# EAGLE design riser-1u-sdcard (EAGLE 5.09)
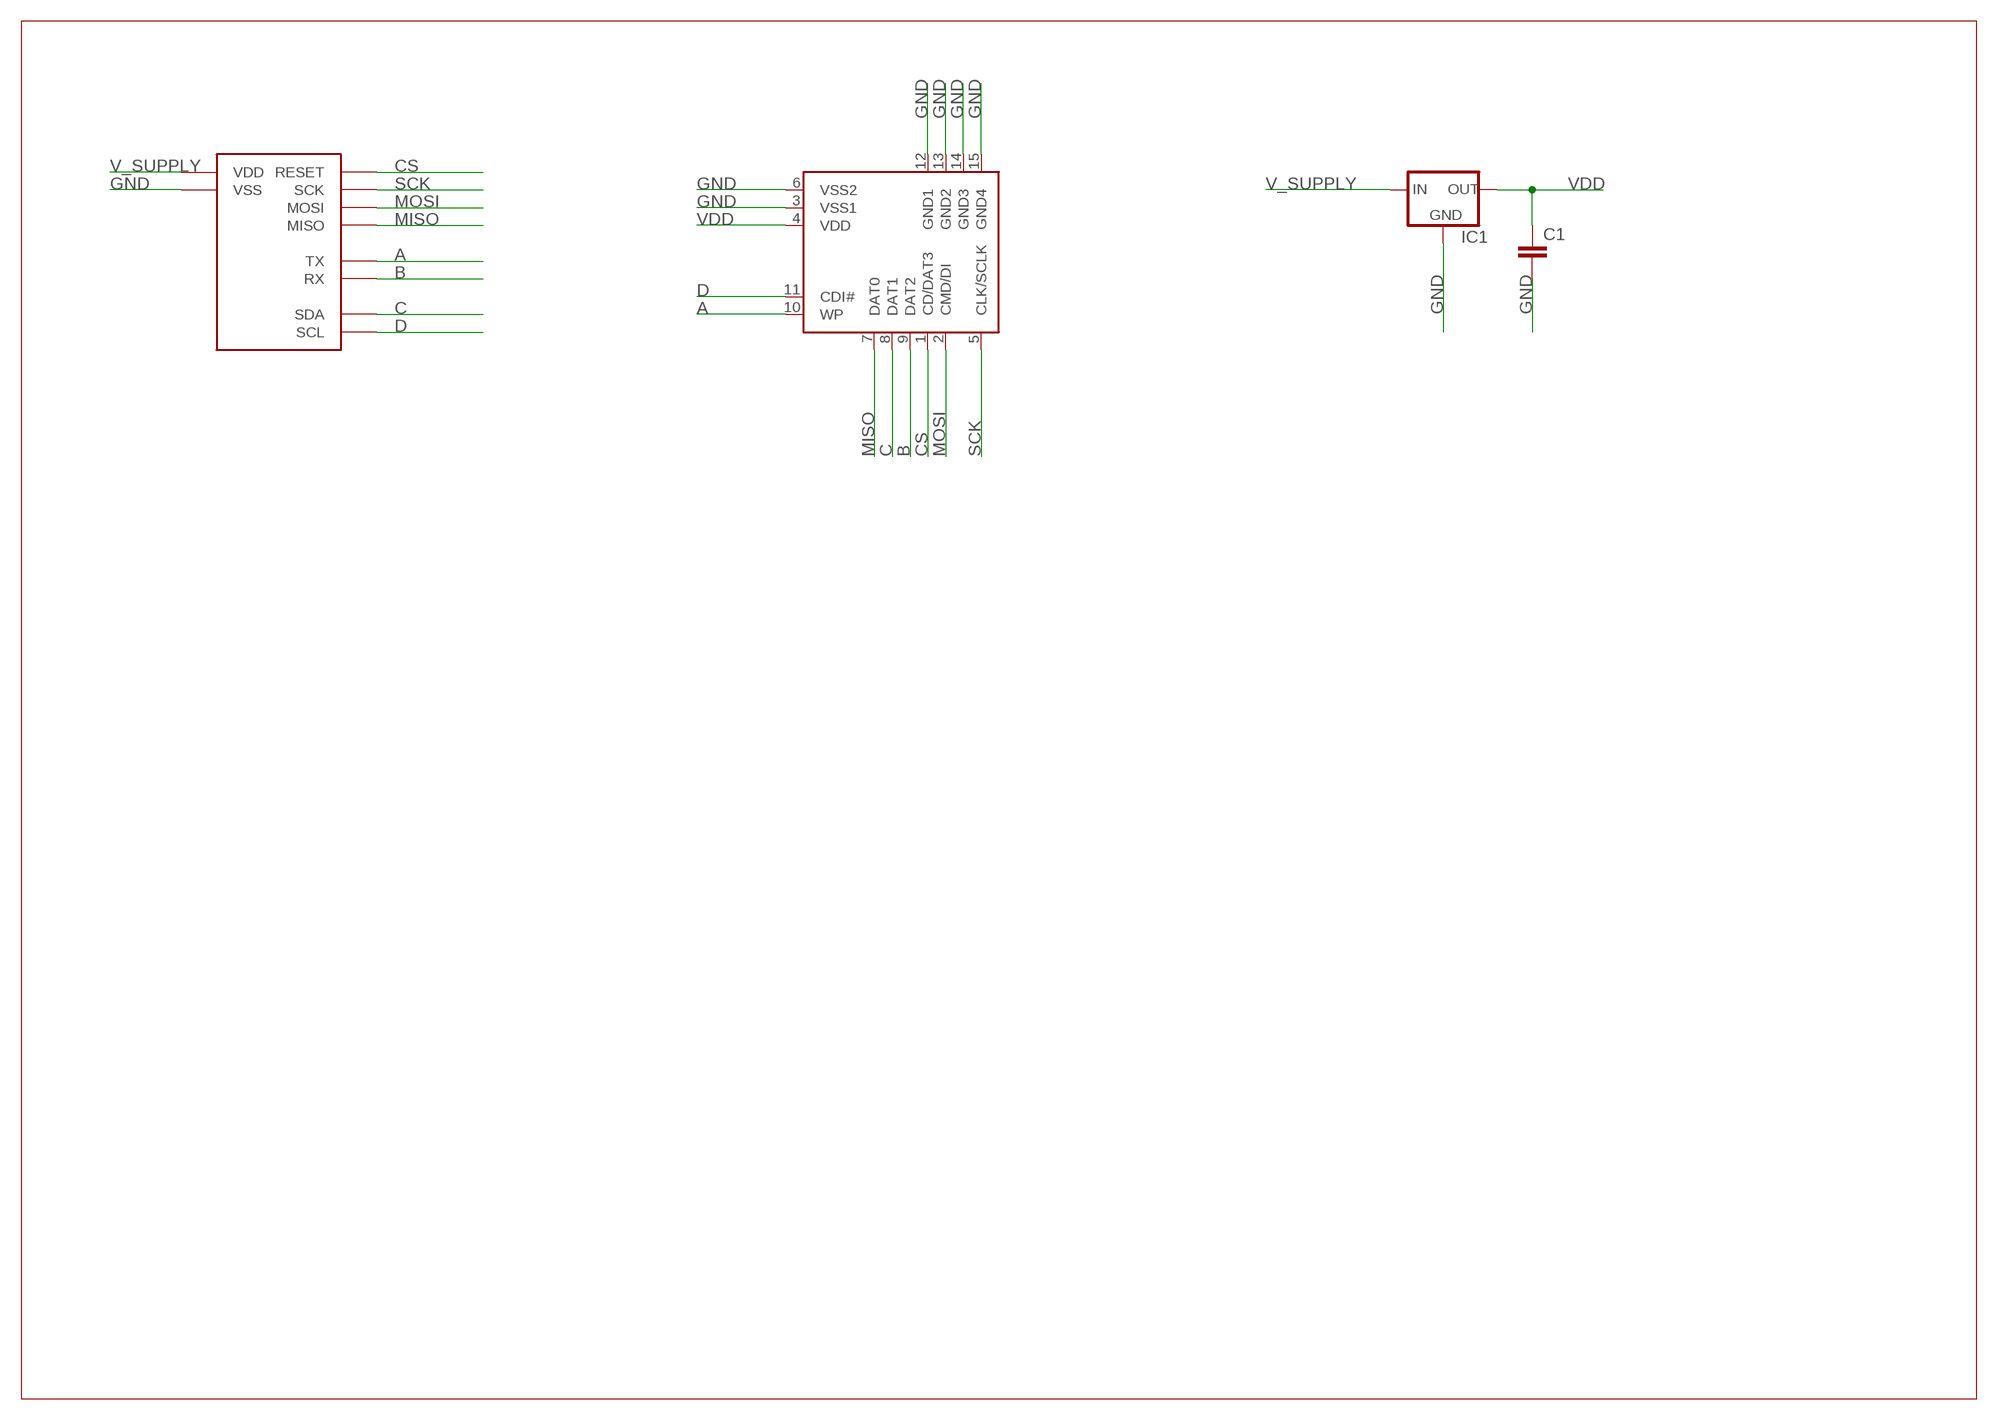
[diagram p0: schematic, sheet 1]

## Parts
C1  C-EUC1206  [C1206]
IC1  LM1117TO252  [TO252]
U$1  UNI_BOARD_CONNECTOR_10  [UNI_BOARD_CONN_10]
U$2  SDCARDVAR2  [SDCMF-10915W010]

## Nets
A: U$1.C$7(TX) U$2.10(WP)
B: U$1.C$9(RX) U$2.9(DAT2)
C: U$1.C$8(SDA) U$2.8(DAT1)
CS: U$1.C$5(RESET) U$2.1(CD/DAT3)
D: U$1.C$10(SCL) U$2.11(CDI#)
GND: C1.2 IC1.1(GND) U$1.C$6(VSS) U$2.3(VSS1) U$2.6(VSS2) U$2.12(GND1) U$2.13(GND2) U$2.14(GND3) U$2.15(GND4)
MISO: U$1.C$1(MISO) U$2.7(DAT0)
MOSI: U$1.C$4(MOSI) U$2.2(CMD/DI)
SCK: U$1.C$3(SCK) U$2.5(CLK/SCLK)
V_SUPPLY: IC1.2(IN) U$1.C$2(VDD)
VDD: C1.1 IC1.3(OUT) U$2.4(VDD)

## Library data of the parts
C1 = rcl:C-EU: CAPACITOR, European symbol
IC1 = my-v-reg-3:LM1117
U$1 = my-uni-board-conn:UNI_BOARD_CONNECTOR_10
U$2 = kingfont_sdcmf10915w010_covek:SDCARD: SD card connector KINGFONT SDCMF-10915W010

## Net classes
1 isolated: width 0.813 mm, clearance 2.54 mm

## Board
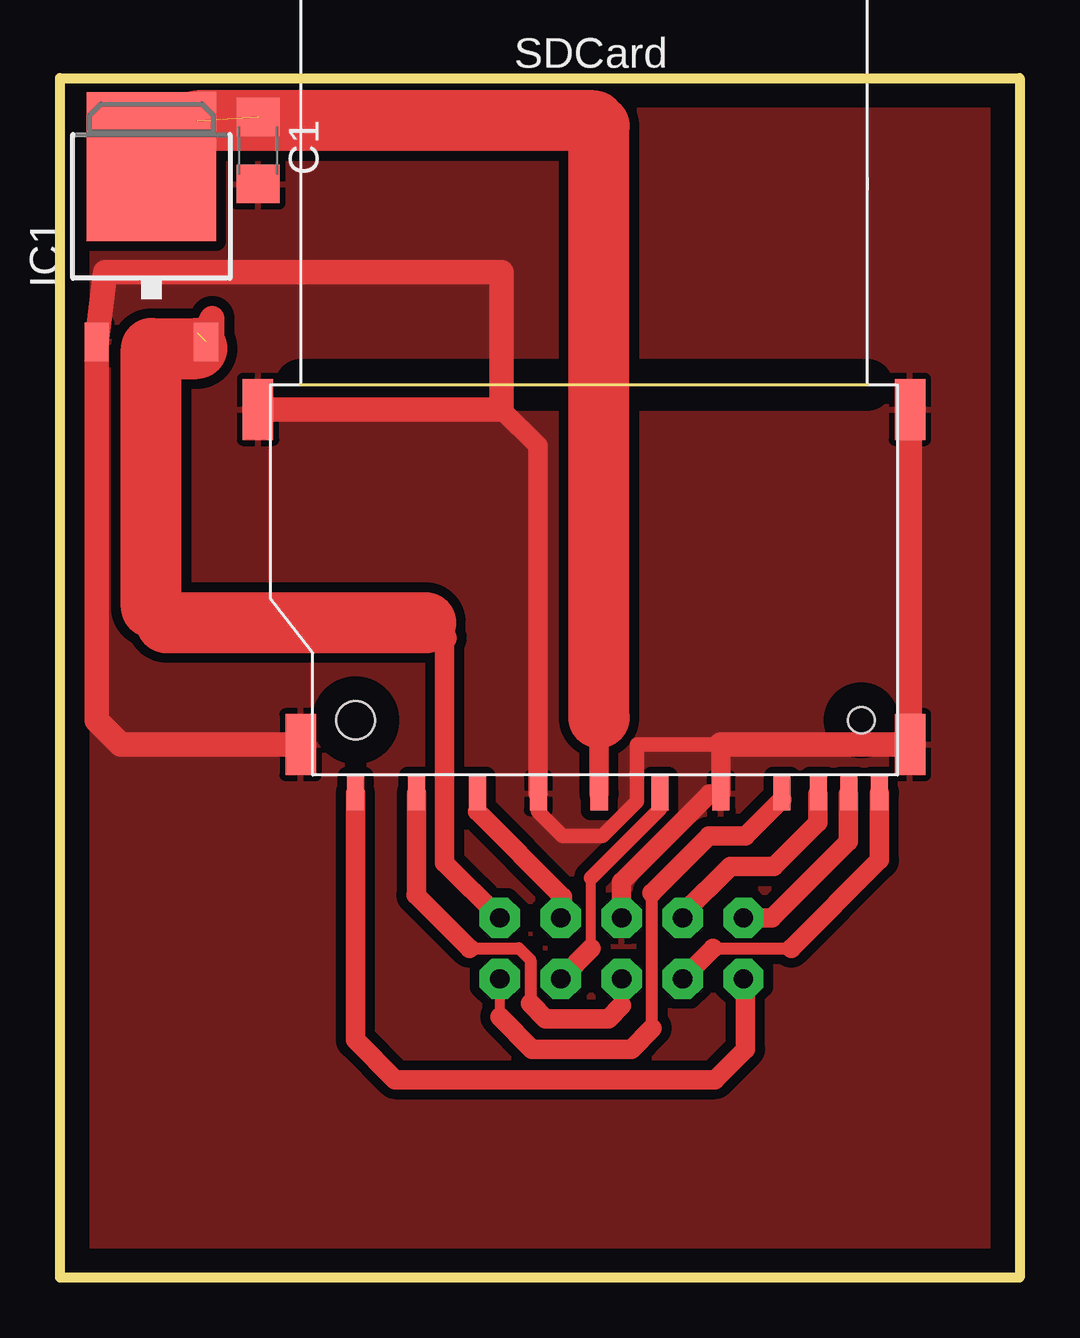
[diagram p1: board, top side]
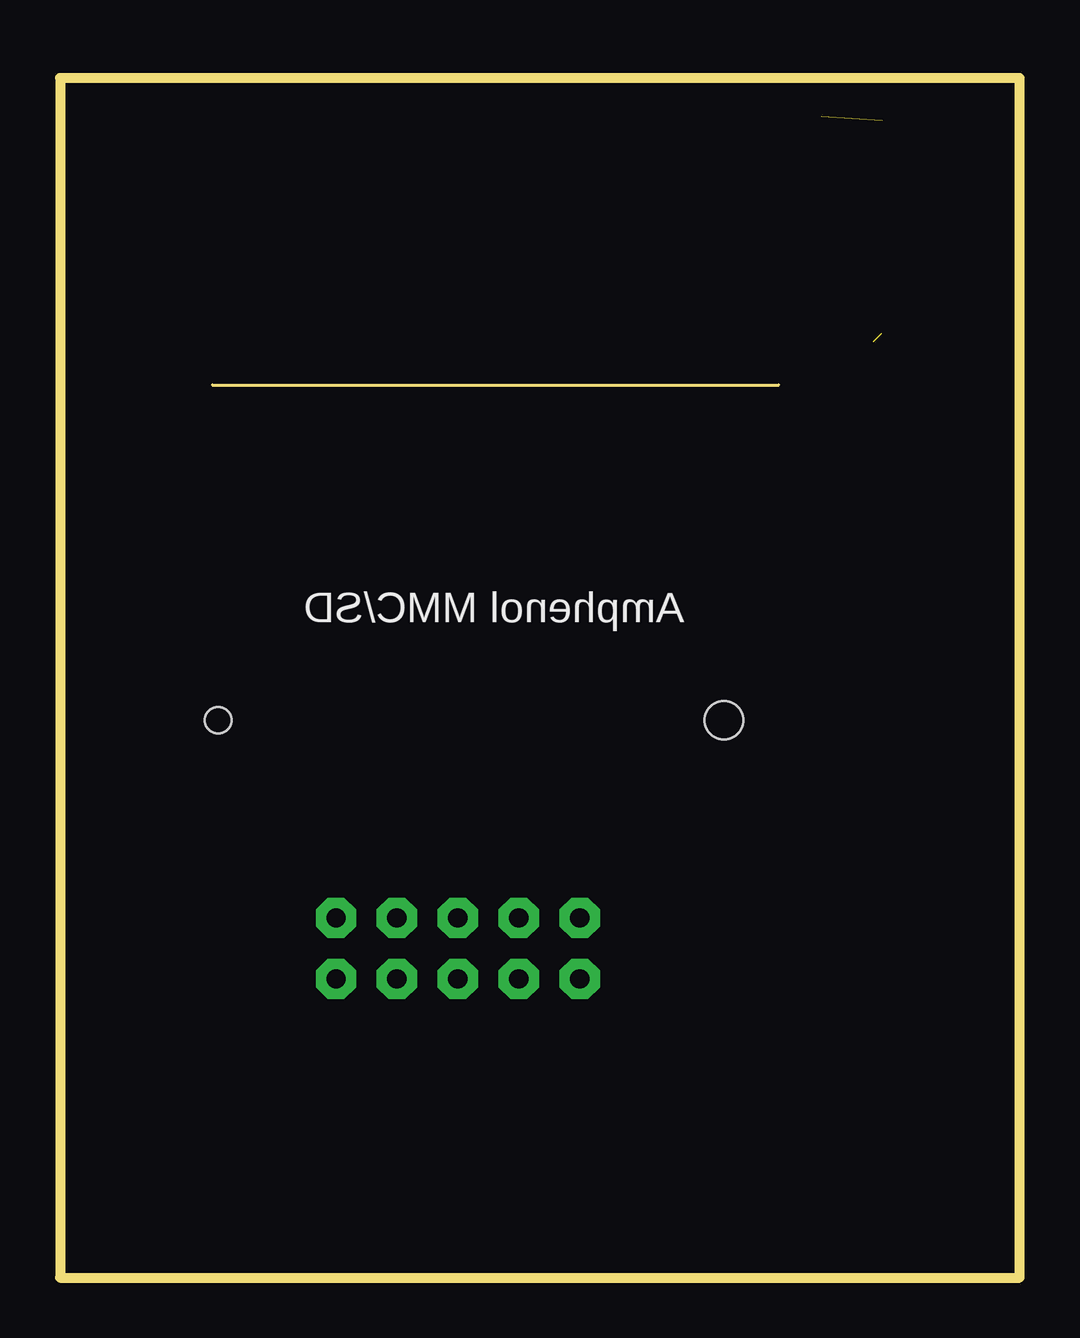
[diagram p2: board, bottom side, seen from below]

Size 40 x 50 mm. Coordinates in mm from the lower left corner, seen from the top.
Outline: 0,0 0,50 40,50 40,0 0,0
Copper layers (1*16): Top 0.035mm / dielectric 1.5mm / Bottom 0.035mm
Design rules "default": minimum track width 10mil, minimum drill 24mil, track to track 8mil, track to pad 8mil, pad to pad 8mil, via to via 8mil, smd to smd 8mil, copper to edge 40mil, drill to drill 8mil, minimum pad ring 10mil, minimum via ring 8mil, stop-mask expansion 4mil, vias tented up to drill 0mil, thermal gap 10mil

### Footprints (pad centres in the part's own frame; a part is rotated, then mirrored left to right if it is on the bottom)
C1206 = smd 1.6 x 1.8: 1 -1.4,0; 2 1.4,0
TO252 = smd 1 x 1.6: 1 -2.28,-6.07; 2 2.28,-6.07 | smd 5.4 x 6.2: 3 0,1.23
UNI_BOARD_CONN_10 = drill 0.8 pad 1.676 octagon: C$1 6.35,1.27; C$2 6.35,-1.27; C$3 3.81,1.27; C$4 3.81,-1.27; C$5 1.27,1.27; C$6 1.27,-1.27; C$7 -1.27,1.27; C$8 -1.27,-1.27; C$9 -3.81,1.27; C$10 -3.81,-1.27
SDCMF-10915W010 = smd 0.711 x 1.422: 1 7.366,13.462; 2 4.826,13.462; 3 2.286,13.462; 4 -0.254,13.462; 5 -2.794,13.462; 6 -5.334,13.462; 7 -7.874,13.462; 8 -9.398,13.462; 9 9.906,13.462; 10 -11.938,13.462; 11 -10.668,13.462 | smd 1.27 x 2.54: 12 12.192,11.43; 13 13.97,-2.54; 14 -13.208,-2.54; 15 -13.208,11.43 | hole 1.6: 9.906,10.414 | hole 1.1: -11.176,10.414

### Placement (x,y rotation side)
C1  8.26,46.99 270 top
IC1  3.81,45.09 0 top
U$1  24.68,13.73 180 top
U$2  22.23,33.66 180 top

### Tracks (layer width: path | path; a pad name or v marks a point on that pad's centre or on a via)
A
  Top 0.508: 27.23,13.73 30.48,13.73
  Top 0.813: U$2.10 34.16,17.41 30.48,13.73 | U$1.C$7 27.23,13.73
B
  Top 0.406: 28.57,12.38 U$1.C$9
  Top 0.813: U$2.9 12.32,9.91 13.97,8.26 27.3,8.26 28.57,9.53 28.57,12.38
C
  Top 0.406: 31.59,20.16 U$2.8
  Top 0.813: U$1.C$8 25.95,15.16 27.94,17.14 29.77,17.14 31.59,18.97 31.59,20.16
CS
  Top 0.406: 14.86,15.97 arc-90 14.84,15.95
  Top 0.508: 23.41,11.35 U$1.C$5 | 19.61,11.43 19.61,13.26 19.13,13.73 17.07,13.73
  Top 0.813: 23.41,11.35 22.86,10.79 20.24,10.79 19.61,11.43 | 14.84,15.95 17.07,13.73 | 14.86,15.97 U$2.1
D
  Top 0.406: 32.86,20.16 U$2.11
  Top 0.813: U$1.C$10 29.68,15 32.86,18.18 32.86,20.16
GND
  Top 0.406: U$2.12 8.89,22.35 | 27.07,20.16 27.53,20.16 U$2.6 | 19.92,19.45 19.92,20.18 U$2.3
  Top 0.61: 27.56,22.23 24.05,22.23 24.05,19.84 22.62,18.41 20.95,18.41 19.92,19.45
  Top 0.813: 27.56,22.23 U$2.6 | U$1.C$6 23.41,16.51 27.07,20.16 | 19.92,20.18 19.92,34.69 18.41,36.2
  Top 1.016: U$2.12 2.54,22.23 1.53,23.23 IC1.1 1.89,41.91 18.41,41.91 18.41,36.2 U$2.13 | U$2.14 U$2.15 27.56,22.23
  pour Top (isolate 0.406): 0,50.16 40.01,50.16 40.01,0 0,0
MISO
  Top 0.406: 18.34,10.88 U$1.C$1 | 30.1,19.94 U$2.7
  Top 0.508: 24.69,10.4 24.69,16.05
  Top 0.813: 24.69,10.4 23.81,9.53 19.68,9.53 18.34,10.88 | 30.1,19.94 28.57,18.41 27.05,18.41 24.69,16.05
MOSI
  Top 0.406: U$2.2 17.4,19.43 | 20.95,15.08 U$1.C$4
  Top 0.813: 17.4,19.43 20.95,15.88 20.95,15.08
SCK
  Top 0.406: 22.15,13.73 22.15,16.67 | 25.02,19.54 U$2.5
  Top 0.61: 22.15,16.67 25.02,19.54
  Top 0.813: U$1.C$3 22.15,13.73
V_SUPPLY  (1 unrouted)
  Top 0.406: IC1.2 6.09,38.48 | 5.74,39.37 5.71,39.37
  Top 0.813: U$1.C$2 16.03,17.3 16.03,26.67
  Top 1.016: 4.45,27.3 3.81,27.94 | 15.24,27.3 16.03,26.67 | 5.71,38.73 6.35,40.01 6.35,39.02 IC1.2
  Top 2.54: 4.45,27.3 15.24,27.3 | 3.81,27.94 3.81,38.73 5.71,38.73
VDD  (1 unrouted)
  Top 0.406: 5.71,48.22 arc90 IC1.3 | 22.27,48.22 arc-90 21.04,48.26 22.23,48.26 22.48,48.01
  Top 0.813: U$2.4 22.46,20.21 22.46,23.34
  Top 2.54: 22.27,48.22 5.71,48.22 | 22.46,23.34 22.48,23.35 22.48,48.01

### Text on the board
tOrigins: VDD | MOSI | VSS | SDA | SCL | TX | RX | MISO | SCK | RESET
tNames: GND | 2Y | 2A | 2OE | 1Y | 1A | 1OE | 3Y | 3A | 3OE | 4Y | 4A | 4OE | VCC